# Altium schematic sheet CM6206_PINOUT.SchDoc
size C; SheetNumber: 3; SheetTotal: 16
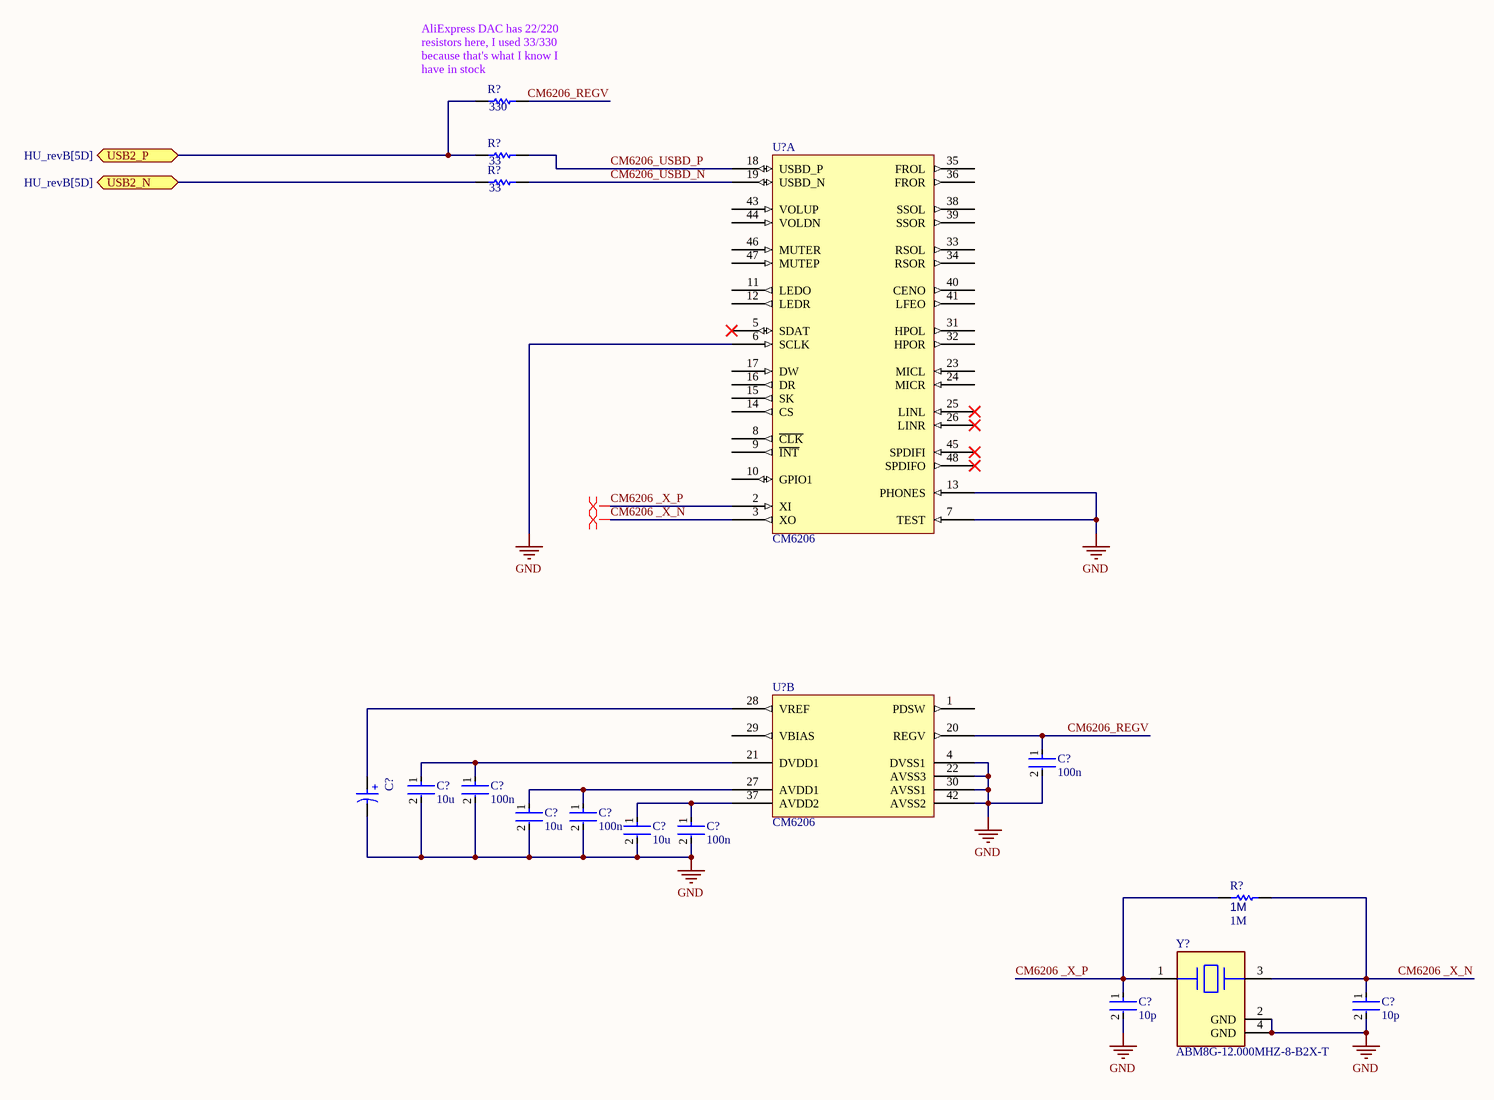
[diagram p0: CM6206_PINOUT.SchDoc]

## Parts
(Parts that share a designator on the sheet are numbered #1, #2 ... from top to bottom, then left to right.)
C?#1  100n  [FP-0402-L_1_0_0_05-W_0_5-IPC_A]
C?#2  875105242010  [WCAP-PSLP_D5H5.5]  (value not drawn)
C?#3  10u  [FP-0402-L_1_0_0_05-W_0_5-IPC_A]
C?#4  100n  [FP-0402-L_1_0_0_05-W_0_5-IPC_A]
C?#5  10u  [FP-0402-L_1_0_0_05-W_0_5-IPC_A]
C?#6  100n  [FP-0402-L_1_0_0_05-W_0_5-IPC_A]
C?#7  10u  [FP-0402-L_1_0_0_05-W_0_5-IPC_A]
C?#8  100n  [FP-0402-L_1_0_0_05-W_0_5-IPC_A]
C?#9  10p  [FP-0402-L_1_0_0_05-W_0_5-IPC_A]
C?#10  10p  [FP-0402-L_1_0_0_05-W_0_5-IPC_A]
R?#1  330  [R0603B]
R?#2  33  [R0603B]
R?#3  33  [R0603B]
R?#4  1M  [R0603B]
U?#1  CM6206  [CQFP50P900X900X160-48N]  (part A of 2)
U?#2  CM6206  [CQFP50P900X900X160-48N]  (part B of 2)
Y?  ABM8G-12.000MHZ-8-B2X-T  [FP-ABM8G-MFG]

## Ports
USB2_N (bidir, see HU_revB[5D]), USB2_P (bidir, see HU_revB[5D])

## Nets
GND: C?#1.2 C?#2.2(N) C?#3.2 C?#4.2 C?#5.2 C?#6.2 C?#7.2 C?#8.2 C?#9.2 C?#10.2 U?#1.6(SCLK) U?#1.7(TEST) U?#1.13(PHONES) U?#2.4(DVSS1) U?#2.22(AVSS3) U?#2.30(AVSS1) U?#2.42(AVSS2) Y?.2(GND) Y?.4(GND)
CM6206 _X_N: C?#10.1 R?#4.1 U?#1.3(XO) Y?.3
CM6206 _X_P: C?#9.1 R?#4.2 U?#1.2(XI) Y?.1
CM6206_REGV: C?#1.1 R?#1.1 U?#2.20(REGV)
CM6206_USBD_N: R?#3.1 U?#1.19(USBD_N)
CM6206_USBD_P: R?#2.1 U?#1.18(USBD_P)
USB2_N: R?#3.2 ; port USB2_N
USB2_P: R?#1.2 R?#2.2 ; port USB2_P
NetC?#2_1: C?#2.1(P) U?#2.28(VREF)
NetC?#3_1: C?#3.1 C?#4.1 U?#2.21(DVDD1)
NetC?#5_1: C?#5.1 C?#6.1 U?#2.27(AVDD1)
NetC?#7_1: C?#7.1 C?#8.1 U?#2.37(AVDD2)

Not connected (* = marked no-connect by the designer): U?#1 5(SDAT)* 8(~{CLK}) 9(~{INT}) 10(GPIO1) 11(LEDO) 12(LEDR) 14(CS) 15(SK) 16(DR) 17(DW) 23(MICL) 24(MICR) 25(LINL)* 26(LINR)* 31(HPOL) 32(HPOR) 33(RSOL) 34(RSOR) 35(FROL) 36(FROR) 38(SSOL) 39(SSOR) 40(CENO) 41(LFEO) 43(VOLUP) 44(VOLDN) 45(SPDIFI)* 46(MUTER) 47(MUTEP) 48(SPDIFO)*; U?#2 1(PDSW) 29(VBIAS)

## Layout directives
differential pair: CM6206 _X_N, CM6206 _X_P

## Notes on the sheet
- (near R?#1) AliExpress DAC has 22/220 resistors here, I used 33/330 because that's what I know I have in stock
- (in symbol CMP-207835-000001-3) +

## Library data of the parts
C?#1 C?#3-C?#10 = CMP-001-00058-1: LARGE PADS, 0402 CAP, CHANGE COMMENT TO MATCH REAL P/N; Capacitor Type: Ceramic; Min Operating Temperature: -55°C; Mounting Technology: Surface Mount; Pins: 2; Case/Package: 0402; RoHS Compliant: Yes; Max Operating Temperature: 85°C
C?#2 = CMP-207835-000001-3: WCAP-PSLP Radial Can - SMD Aluminum Polymer Capacitor 0.197Dia 5.00mm ±20% 100muF 10V; Capacitance: 100µF; Leakage Current: 300µA; ESR (Equivalent Series Resistance): 30mΩ; Life (Hours): 2000hours; Polarity: Polar; Pitch: 5.3mm; Ripple Current: 1.97A; Dissipation Factor: 8%; Material: Polymer; Height: 5.5mm; Min Operating Temperature: -55°C; Max Operating Temperature: 105°C; Voltage Rating: 10V; Packaging: Tape & Reel (TR); RoHS: Compliant; Tolerance: 20%; REACH SVHC: Unknown; Length: 5.5mm; Mount: Surface Mount; Voltage Rating (DC): 10V; Diameter: 5mm; Height - Seated (Max): 5.5118mm; Case/Package: Radial
R?#1-R?#3 = CMP-009-00002-14: Resistor; Value: 220
R?#4 = CMP-009-00002-14: Resistor; Value: 1M
U?#1 U?#2 = CMP-015-00016-2: Highly Integrated USB Audio I/O Controller
Y? = CMP-27762-015492-1: Crystal 12MHz ±20ppm (Tol) ±20ppm (Stability) 8pF FUND 120Ω 4-Pin SMD T/R